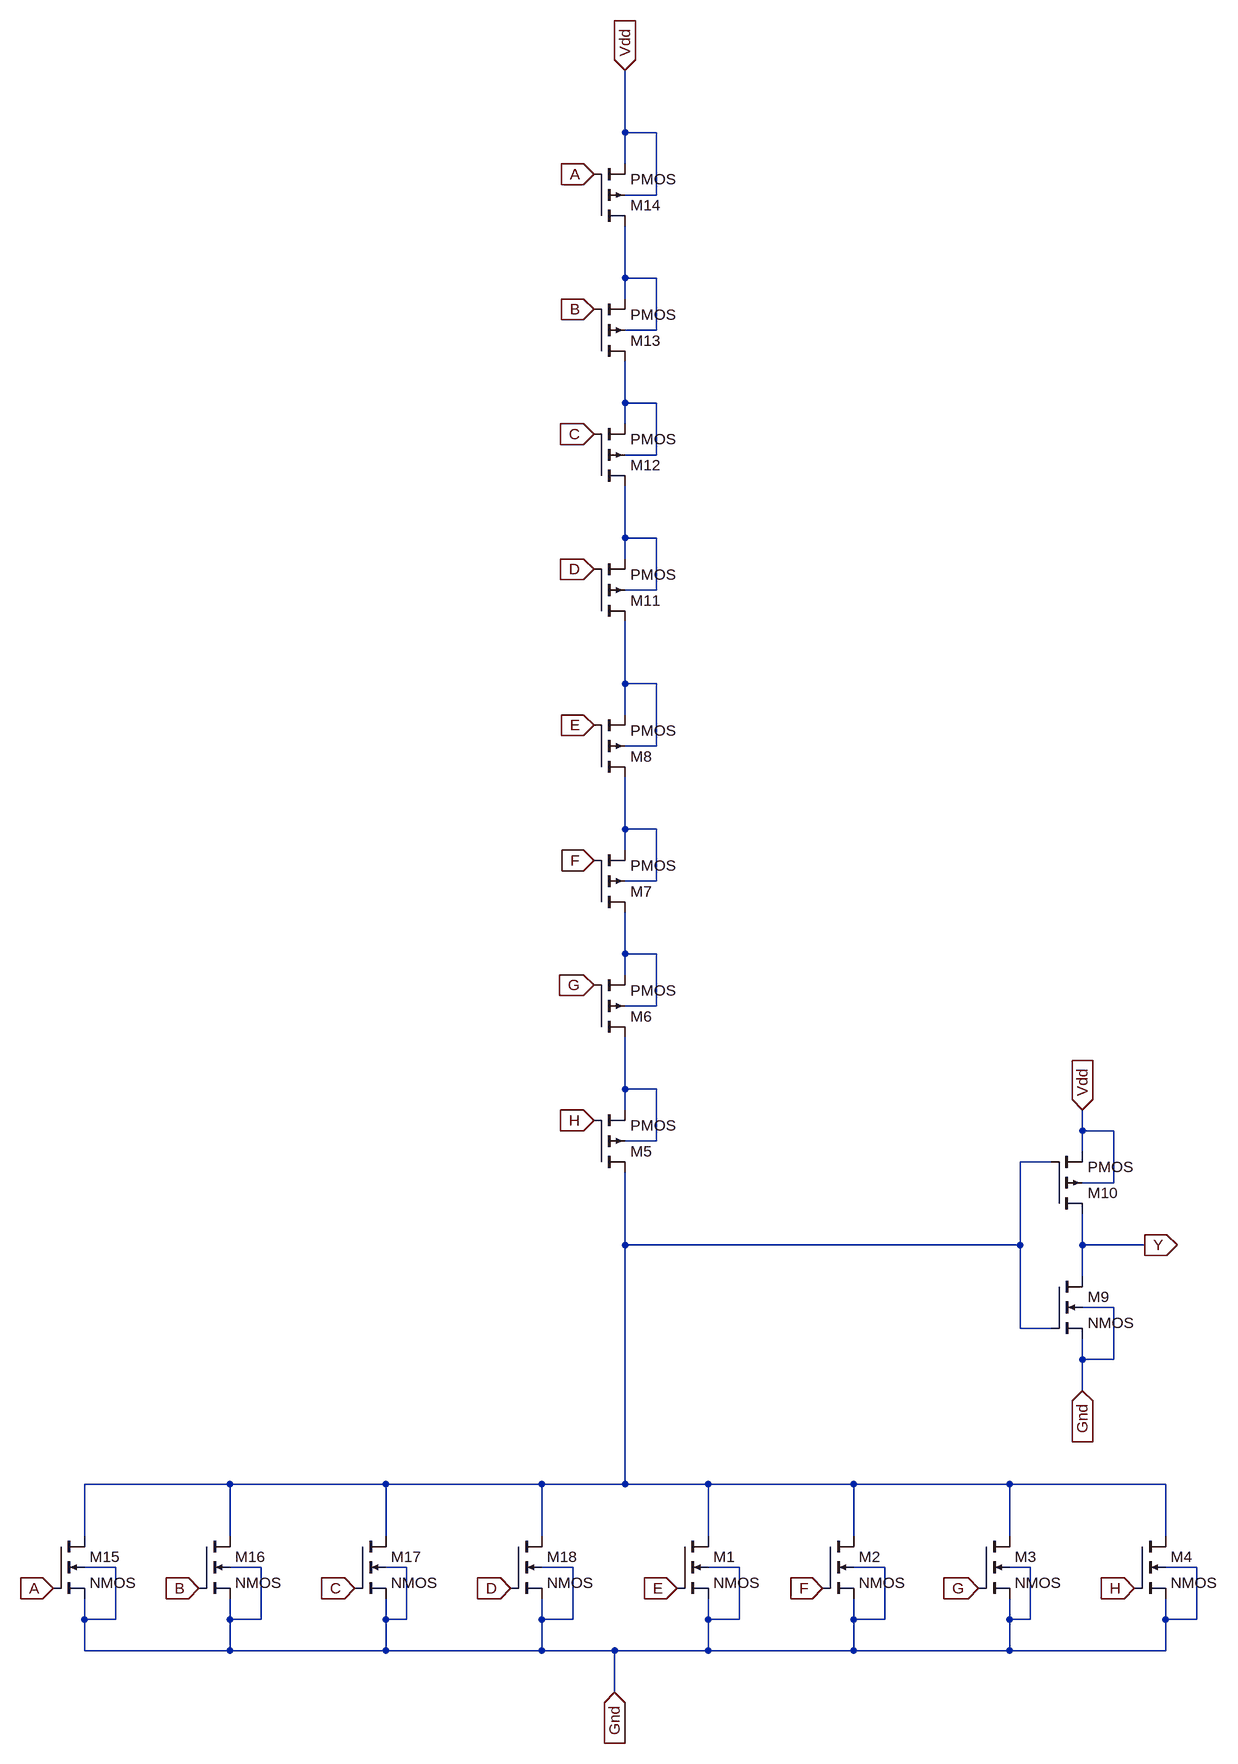
[diagram p0: schematic 8i_OR.asc]
8i_OR.asc, the LTspice schematic file:
Version 4
SHEET 1 1092 1256
WIRE 176 -1248 176 -1344
WIRE 224 -1248 176 -1248
WIRE 176 -1200 176 -1248
WIRE 224 -1152 224 -1248
WIRE 224 -1152 176 -1152
WIRE 176 -1024 176 -1104
WIRE 224 -1024 176 -1024
WIRE 176 -992 176 -1024
WIRE 224 -944 224 -1024
WIRE 224 -944 176 -944
WIRE 176 -832 176 -896
WIRE 224 -832 176 -832
WIRE 176 -800 176 -832
WIRE 224 -752 224 -832
WIRE 224 -752 176 -752
WIRE 176 -624 176 -704
WIRE 224 -624 176 -624
WIRE 176 -592 176 -624
WIRE 224 -544 224 -624
WIRE 224 -544 176 -544
WIRE 176 -400 176 -496
WIRE 224 -400 176 -400
WIRE 176 -352 176 -400
WIRE 224 -304 224 -400
WIRE 224 -304 176 -304
WIRE 176 -176 176 -256
WIRE 224 -176 176 -176
WIRE 176 -144 176 -176
WIRE 224 -96 224 -176
WIRE 224 -96 176 -96
WIRE 176 16 176 -48
WIRE 224 16 176 16
WIRE 176 48 176 16
WIRE 224 96 224 16
WIRE 224 96 176 96
WIRE 176 224 176 144
WIRE 224 224 176 224
WIRE 176 256 176 224
WIRE 880 288 880 256
WIRE 928 288 880 288
WIRE 224 304 224 224
WIRE 224 304 176 304
WIRE 880 320 880 288
WIRE 832 336 784 336
WIRE 928 368 928 288
WIRE 928 368 880 368
WIRE 176 464 176 352
WIRE 784 464 784 336
WIRE 784 464 176 464
WIRE 880 464 880 416
WIRE 976 464 880 464
WIRE 880 512 880 464
WIRE 928 560 880 560
WIRE 784 592 784 464
WIRE 832 592 784 592
WIRE 880 640 880 608
WIRE 928 640 928 560
WIRE 928 640 880 640
WIRE 880 688 880 640
WIRE -432 832 -656 832
WIRE -192 832 -432 832
WIRE 48 832 -192 832
WIRE 176 832 176 464
WIRE 176 832 48 832
WIRE 304 832 176 832
WIRE 528 832 304 832
WIRE 768 832 528 832
WIRE 1008 832 768 832
WIRE -656 912 -656 832
WIRE -432 912 -432 832
WIRE -192 912 -192 832
WIRE 48 912 48 832
WIRE 304 912 304 832
WIRE 528 912 528 832
WIRE 768 912 768 832
WIRE 1008 912 1008 832
WIRE -608 960 -656 960
WIRE -384 960 -432 960
WIRE -160 960 -192 960
WIRE 96 960 48 960
WIRE 352 960 304 960
WIRE 576 960 528 960
WIRE 800 960 768 960
WIRE 1056 960 1008 960
WIRE -656 1040 -656 1008
WIRE -608 1040 -608 960
WIRE -608 1040 -656 1040
WIRE -432 1040 -432 1008
WIRE -384 1040 -384 960
WIRE -384 1040 -432 1040
WIRE -192 1040 -192 1008
WIRE -160 1040 -160 960
WIRE -160 1040 -192 1040
WIRE 48 1040 48 1008
WIRE 96 1040 96 960
WIRE 96 1040 48 1040
WIRE 304 1040 304 1008
WIRE 352 1040 352 960
WIRE 352 1040 304 1040
WIRE 528 1040 528 1008
WIRE 576 1040 576 960
WIRE 576 1040 528 1040
WIRE 768 1040 768 1008
WIRE 800 1040 800 960
WIRE 800 1040 768 1040
WIRE 1008 1040 1008 1008
WIRE 1056 1040 1056 960
WIRE 1056 1040 1008 1040
WIRE -656 1088 -656 1040
WIRE -432 1088 -432 1040
WIRE -432 1088 -656 1088
WIRE -192 1088 -192 1040
WIRE -192 1088 -432 1088
WIRE 48 1088 48 1040
WIRE 48 1088 -192 1088
WIRE 160 1088 48 1088
WIRE 304 1088 304 1040
WIRE 304 1088 160 1088
WIRE 528 1088 528 1040
WIRE 528 1088 304 1088
WIRE 768 1088 768 1040
WIRE 768 1088 528 1088
WIRE 1008 1088 1008 1040
WIRE 1008 1088 768 1088
WIRE 160 1152 160 1088
FLAG 128 -336 E
IOPIN 128 -336 In
FLAG 128 -128 F
IOPIN 128 -128 In
FLAG 128 64 G
IOPIN 128 64 In
FLAG 128 272 H
IOPIN 128 272 In
FLAG 256 992 E
IOPIN 256 992 In
FLAG 480 992 F
IOPIN 480 992 In
FLAG 720 992 G
IOPIN 720 992 In
FLAG 960 992 H
IOPIN 960 992 In
FLAG 160 1152 Gnd
IOPIN 160 1152 In
FLAG 880 256 Vdd
IOPIN 880 256 In
FLAG 880 688 Gnd
IOPIN 880 688 In
FLAG 976 464 Y
IOPIN 976 464 Out
FLAG 128 -1184 A
IOPIN 128 -1184 In
FLAG 128 -976 B
IOPIN 128 -976 In
FLAG 128 -784 C
IOPIN 128 -784 In
FLAG 128 -576 D
IOPIN 128 -576 In
FLAG 176 -1344 Vdd
IOPIN 176 -1344 In
FLAG -704 992 A
IOPIN -704 992 In
FLAG -480 992 B
IOPIN -480 992 In
FLAG -240 992 C
IOPIN -240 992 In
FLAG 0 992 D
IOPIN 0 992 In
SYMBOL nmos4 256 912 R0
SYMATTR InstName M1
SYMBOL nmos4 480 912 R0
SYMATTR InstName M2
SYMBOL nmos4 720 912 R0
SYMATTR InstName M3
SYMBOL nmos4 960 912 R0
SYMATTR InstName M4
SYMBOL pmos4 128 352 M180
SYMATTR InstName M5
SYMBOL pmos4 128 144 M180
SYMATTR InstName M6
SYMBOL pmos4 128 -48 M180
SYMATTR InstName M7
SYMBOL pmos4 128 -256 M180
SYMATTR InstName M8
SYMBOL nmos4 832 512 R0
SYMATTR InstName M9
SYMBOL pmos4 832 416 M180
SYMATTR InstName M10
SYMBOL pmos4 128 -496 M180
SYMATTR InstName M11
SYMBOL pmos4 128 -704 M180
SYMATTR InstName M12
SYMBOL pmos4 128 -896 M180
SYMATTR InstName M13
SYMBOL pmos4 128 -1104 M180
SYMATTR InstName M14
SYMBOL nmos4 -704 912 R0
SYMATTR InstName M15
SYMBOL nmos4 -480 912 R0
SYMATTR InstName M16
SYMBOL nmos4 -240 912 R0
SYMATTR InstName M17
SYMBOL nmos4 0 912 R0
SYMATTR InstName M18

The netlist it stands for:
* 8i_OR.asc
M1 N008 E Gnd Gnd NMOS
M2 N008 F Gnd Gnd NMOS
M3 N008 G Gnd Gnd NMOS
M4 N008 H Gnd Gnd NMOS
M5 N008 H N007 N007 PMOS
M6 N007 G N006 N006 PMOS
M7 N006 F N005 N005 PMOS
M8 N005 E N004 N004 PMOS
M9 Y N008 Gnd Gnd NMOS
M10 Y N008 Vdd Vdd PMOS
M11 N004 D N003 N003 PMOS
M12 N003 C N002 N002 PMOS
M13 N002 B N001 N001 PMOS
M14 N001 A Vdd Vdd PMOS
M15 N008 A Gnd Gnd NMOS
M16 N008 B Gnd Gnd NMOS
M17 N008 C Gnd Gnd NMOS
M18 N008 D Gnd Gnd NMOS
.model NMOS NMOS
.model PMOS PMOS
.lib standard.mos
.backanno
.end